# Altium project Do_an_1.PrjPcb
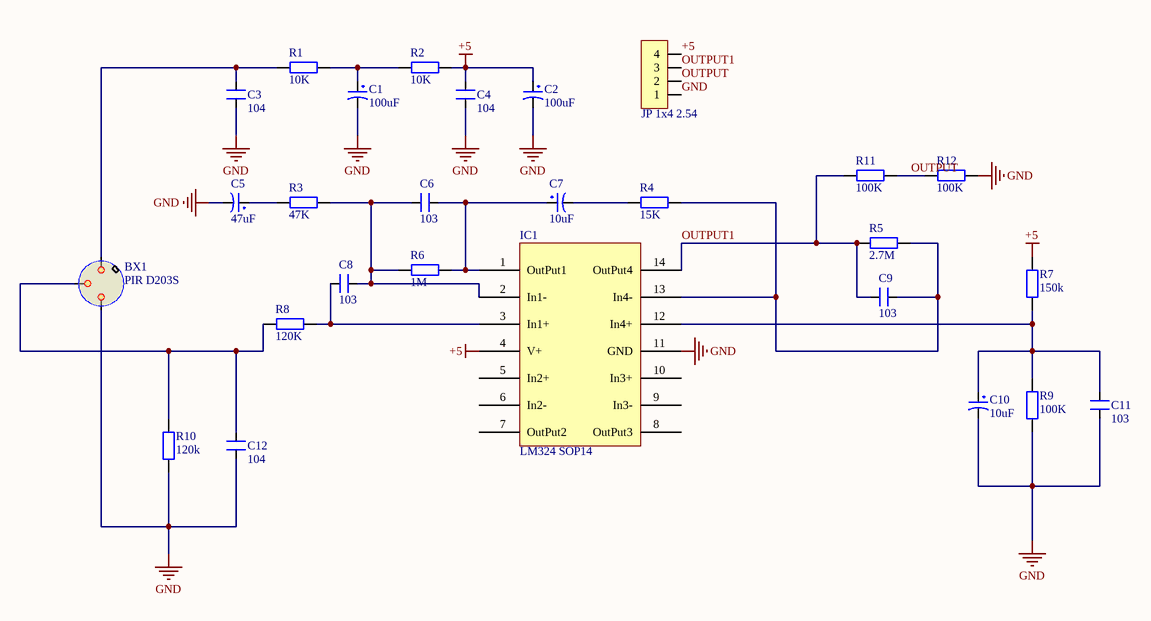
[diagram p0: do_an.SchDoc]
1 sheet, 27 parts. Net scope: global (net labels, ports and power ports of the same name join across sheets).
Board files: do_an_v2.PcbDoc, do_an.PcbDoc

## Sheet do_an.SchDoc
size D; SheetNumber: 1; SheetTotal: 1

### Parts
BX1  PIR D203S  [BXR315A]
C1  100uF  [CP1/2]
C2  100uF  [CP1/2]
C3  104  [SM-0805]
C4  104  [SM-0805]
C5  47uF  [CP1/2]
C6  103  [SM-0805]
C7  10uF  [CP1/2]
C8  103  [SM-0805]
C9  103  [SM-0805]
C10  10uF  [CP1/2]
C11  103  [SM-0805]
C12  104  [SM-0805]
IC1  LM324 SOP14  [sop 14]
JP?  JP 1x4 2.54  [JP 1x4 DT]
R1  10K  [SM-1206]
R2  10K  [SM-1206]
R3  47K  [SM-1206]
R4  15K  [SM-1206]
R5  2.7M  [SM-1206]
R6  1M  [SM-1206]
R7  150k  [SM-1206]
R8  120K  [SM-1206]
R9  100K  [SM-1206]
R10  120k  [SM-1206]
R11  100K  [SM-1206]
R12  100K  [SM-1206]

### Nets
+5: C2.1 C4.2 IC1.4(V+) JP?.4 R2.2 R7.1
GND: BX1.3 C1.2 C2.2 C3.1 C4.1 C5.2 C10.2 C11.1 C12.1 IC1.11(GND) JP?.1 R9.1 R10.1 R12.1
OUTPUT: JP?.2 R11.1 R12.2
OUTPUT1: C9.2 IC1.14(OutPut4) JP?.3 R5.1 R11.2
NetBX1_1: BX1.1(D) C3.2 R1.1
NetBX1_2: BX1.2 C12.2 R8.1 R10.2
NetC1_1: C1.1 R1.2 R2.1
NetC5_1: C5.1 R3.1
NetC6_1: C6.1 C7.1 IC1.1(OutPut1) R6.2
NetC6_2: C6.2 C8.2 IC1.2(In1-) R3.2 R6.1
NetC7_2: C7.2 R4.1
NetC8_1: C8.1 IC1.3(In1+) R8.2
NetC9_1: C9.1 IC1.13(In4-) R4.2 R5.2
NetC10_1: C10.1 C11.2 IC1.12(In4+) R7.2 R9.2

Not connected (* = marked no-connect by the designer): IC1 5(In2+) 6(In2-) 7(OutPut2) 8(OutPut3) 9(In3-) 10(In3+)

### Library data of the parts
C1 C2 C5 C7 C10 = CP1: Cap P  0,1uF < 22uF , 16 - 50V; Value: 10uF/50V; Description 1: 10 => 220uF/6,3V/10V - 10uF => 100uF/16V; Description 2: 0,1uF => 33uF/50V - 10uF => 22uF/63V; Description 3: 0,47uF => 10uF/100V
C3 C4 C12 = CM: Cap SMD; Value: 103
C6 C8 C9 C11 = CM: Cap SMD; Value: 103
IC1 = LM324 SOP14: Dán; Ma_Hang: MH002173; Don_Vi: Con; Ten_Linh_Kien: LM324 SOP14; Kieu_Chan: *; Ghi_Chu: *; Chung_Loai: Dán
JP? = JP 1x4 2.54 Duc Thang: Cắm; Ten_Linh_Kien: Jump Đơn Đực 2.54MM 1x40P Thẳng 11MM; Don_Vi: Con; Ma_Hang: MH000903; Ghi_Chu: *; Kieu_Chan: *; Chung_Loai: Cắm
R1-R12 = RM: Resistor SMD; Value: 1K